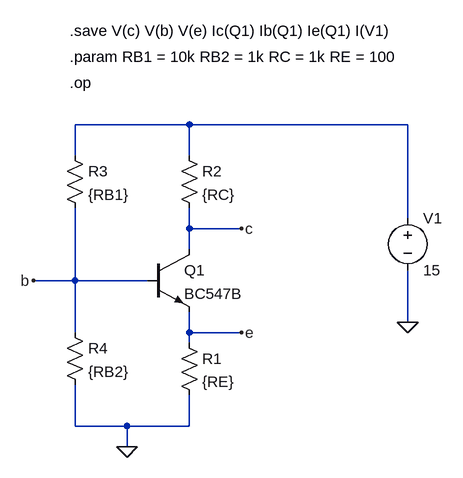
[diagram p0: schematic transistor_polarization.asc]
transistor_polarization.asc, the LTspice schematic file:
Version 4
SHEET 1 880 680
WIRE 224 -80 48 -80
WIRE 560 -80 224 -80
WIRE 48 -32 48 -80
WIRE 224 -32 224 -80
WIRE 560 64 560 -80
WIRE 224 80 224 48
WIRE 304 80 224 80
WIRE 224 112 224 80
WIRE 48 160 48 48
WIRE 48 160 -16 160
WIRE 160 160 48 160
WIRE 560 224 560 144
WIRE 48 240 48 160
WIRE 224 240 224 208
WIRE 304 240 224 240
WIRE 224 256 224 240
WIRE 48 384 48 320
WIRE 128 384 48 384
WIRE 224 384 224 336
WIRE 224 384 128 384
WIRE 128 416 128 384
FLAG 560 224 0
FLAG 128 416 0
FLAG 304 80 c
FLAG 304 240 e
FLAG -16 160 b
SYMBOL npn 160 112 R0
SYMATTR InstName Q1
SYMATTR Value BC547B
SYMBOL res 208 240 R0
SYMATTR InstName R1
SYMATTR Value {RE}
SYMBOL res 208 -48 R0
SYMATTR InstName R2
SYMATTR Value {RC}
SYMBOL res 32 -48 R0
SYMATTR InstName R3
SYMATTR Value {RB1}
SYMBOL res 32 224 R0
SYMATTR InstName R4
SYMATTR Value {RB2}
SYMBOL voltage 560 48 R0
WINDOW 123 0 0 Left 0
WINDOW 39 0 0 Left 0
SYMATTR InstName V1
SYMATTR Value 15
TEXT 40 -184 Left 2 !.param RB1 = 10k RB2 = 1k RC = 1k RE = 100
TEXT 40 -144 Left 2 !.op
TEXT 40 -224 Left 2 !.save V(c) V(b) V(e) Ic(Q1) Ib(Q1) Ie(Q1) I(V1)

The netlist it stands for:
* transistor_polarization.asc
Q1 c b e 0 BC547B
R1 e 0 {RE}
R2 N001 c {RC}
R3 N001 b {RB1}
R4 b 0 {RB2}
V1 N001 0 15
.model NPN NPN
.model PNP PNP
.lib standard.bjt
.param RB1 = 10k RB2 = 1k RC = 1k RE = 100
.op
.save V(c) V(b) V(e) Ic(Q1) Ib(Q1) Ie(Q1) I(V1)
.backanno
.end